# EAGLE schematic maus (EAGLE 9.6.2)

## Sheet 1 of 7
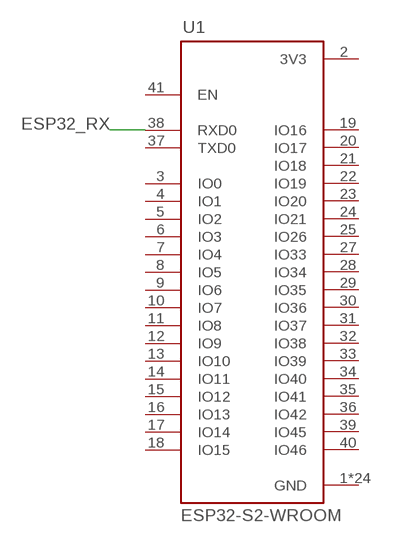
[diagram p0: schematic, sheet 1]

### Parts
U1  ESP32-S2-WROOM  [XCVR_ESP32-S2-WROOM]

### Nets
ESP32_RX: U1.38(RXD0) ; also sheet 3,4
Unconnected: U1.3(IO0) U1.4(IO1) U1.5(IO2) U1.6(IO3) U1.7(IO4) U1.8(IO5) U1.9(IO6) U1.10(IO7) U1.11(IO8) U1.12(IO9) U1.13(IO10) U1.14(IO11) U1.15(IO12) U1.16(IO13) U1.17(IO14) U1.18(IO15) U1.19(IO16) U1.20(IO17) U1.21(IO18) U1.22(IO19) U1.23(IO20) U1.24(IO21) U1.25(IO26) U1.27(IO33) U1.28(IO34) U1.29(IO35) U1.30(IO36) U1.31(IO37) U1.32(IO38) U1.33(IO39) U1.34(IO40) U1.35(IO41) U1.36(IO42) U1.37(TXD0) U1.39(IO45) U1.40(IO46) U1.41(EN)

## Sheet 2 of 7
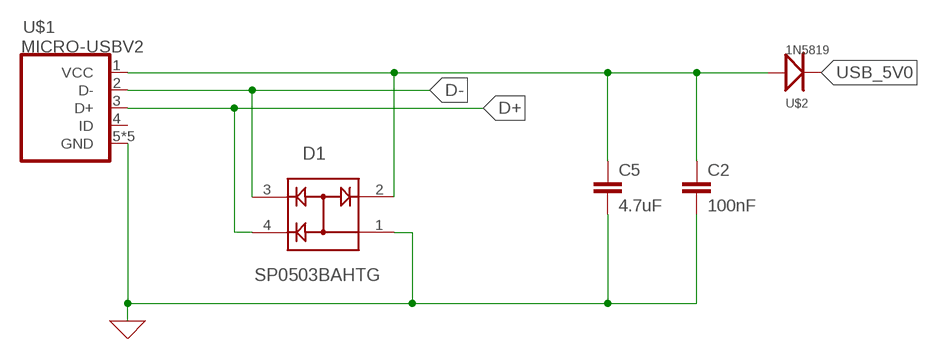
[diagram p1: schematic, sheet 2]

### Parts
C2  100nF  C-EUC0805  [C0805]
C5  4.7uF  C-EUC0805  [C0805]
D1  SP0503BAHTG  [SOT143]
U$1  MICRO-USBV2  [MICRO-USB-2]
U$2  1N5819  [SOD-123]

### Nets
0: C2.2 C5.2 D1.1 U$1.5(GND) U$1.P$1(GND) U$1.P$2(GND) U$1.P$3(GND) U$1.P$4(GND) ; supply symbol labelled GND ; also sheet 3,4
D+: D1.4 U$1.3(D+) ; also sheet 3,4
D-: D1.3 U$1.2(D-) ; also sheet 3,4
USB_5V0: C2.1 C5.1 D1.2 U$1.1(VCC) U$2.A ; also sheet 3,4
Unconnected: U$1.4(ID) U$2.K

## Sheet 3 of 7
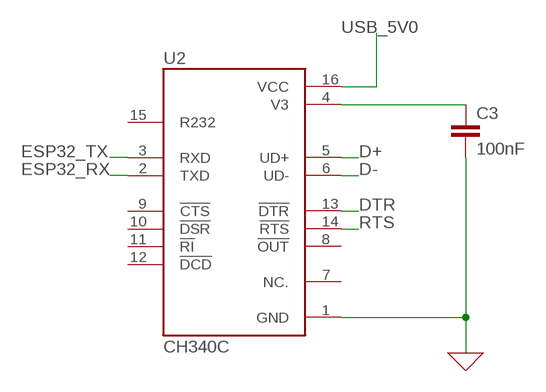
[diagram p2: schematic, sheet 3]

### Parts
C3  100nF  C-EUC0805  [C0805]
U2  CH340C  [SOIC127P600X180-16N]

### Nets
0: C3.2 U2.1(GND) ; supply symbol labelled GND ; also sheet 2,4
D+: U2.5(UD+) ; also sheet 2,4
D-: U2.6(UD-) ; also sheet 2,4
DTR: U2.13(!DTR) ; also sheet 4,5
ESP32_RX: U2.2(TXD) ; also sheet 1,4
ESP32_TX: U2.3(RXD) ; also sheet 4
N$2: C3.1 U2.4(V3)
RTS: U2.14(!RTS) ; also sheet 4,5
USB_5V0: U2.16(VCC) ; also sheet 2,4
Unconnected: U2.7(NC.) U2.8(!OUT) U2.9(!CTS) U2.10(!DSR) U2.11(!RI) U2.12(!DCD) U2.15(R232)

## Sheet 4 of 7
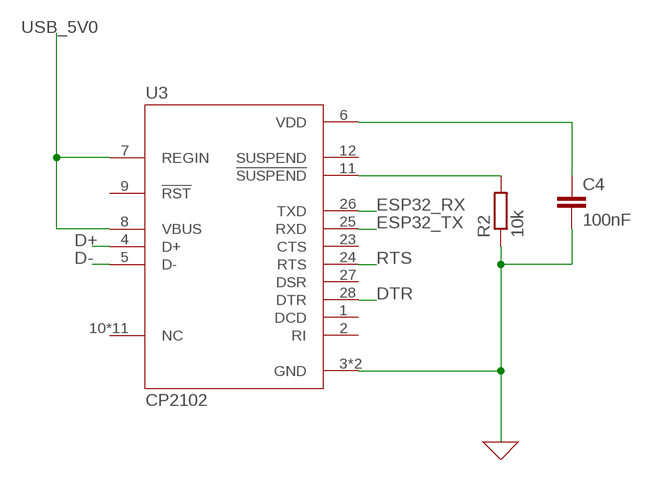
[diagram p3: schematic, sheet 4]

### Parts
C4  100nF  C-EUC0805  [C0805]
R2  10k  R-EU_R0805  [R0805]
U3  CP2102  [QFN50P500X500X100-29N]

### Nets
0: C4.2 R2.1 U3.3(GND) U3.29(GND) ; supply symbol labelled GND ; also sheet 2,3
D+: U3.4(D+) ; also sheet 2,3
D-: U3.5(D-) ; also sheet 2,3
DTR: U3.28(DTR) ; also sheet 3,5
ESP32_RX: U3.26(TXD) ; also sheet 1,3
ESP32_TX: U3.25(RXD) ; also sheet 3
N$3: R2.2 U3.11(!SUSPEND)
N$4: C4.1 U3.6(VDD)
RTS: U3.24(RTS) ; also sheet 3,5
USB_5V0: U3.7(REGIN) U3.8(VBUS) ; also sheet 2,3
Unconnected: U3.1(DCD) U3.2(RI) U3.9(!RST) U3.10(NC) U3.12(SUSPEND) U3.13(NC) U3.14(NC) U3.15(NC) U3.16(NC) U3.17(NC) U3.18(NC) U3.19(NC) U3.20(NC) U3.21(NC) U3.22(NC) U3.23(CTS) U3.27(DSR)

## Sheet 5 of 7
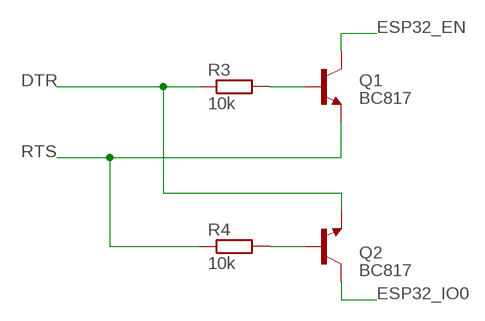
[diagram p4: schematic, sheet 5]

### Parts
Q1  BC817  [SOT95P230X110-3N]
Q2  BC817  [SOT95P230X110-3N]
R3  10k  R-EU_R0805  [R0805]
R4  10k  R-EU_R0805  [R0805]

### Nets
DTR: Q2.2(E) R3.1 ; also sheet 3,4
ESP32_EN: Q1.3(C)
ESP32_IO0: Q2.3(C)
N$5: Q1.1(B) R3.2
N$6: Q2.1(B) R4.2
RTS: Q1.2(E) R4.1 ; also sheet 3,4

## Sheet 6 of 7
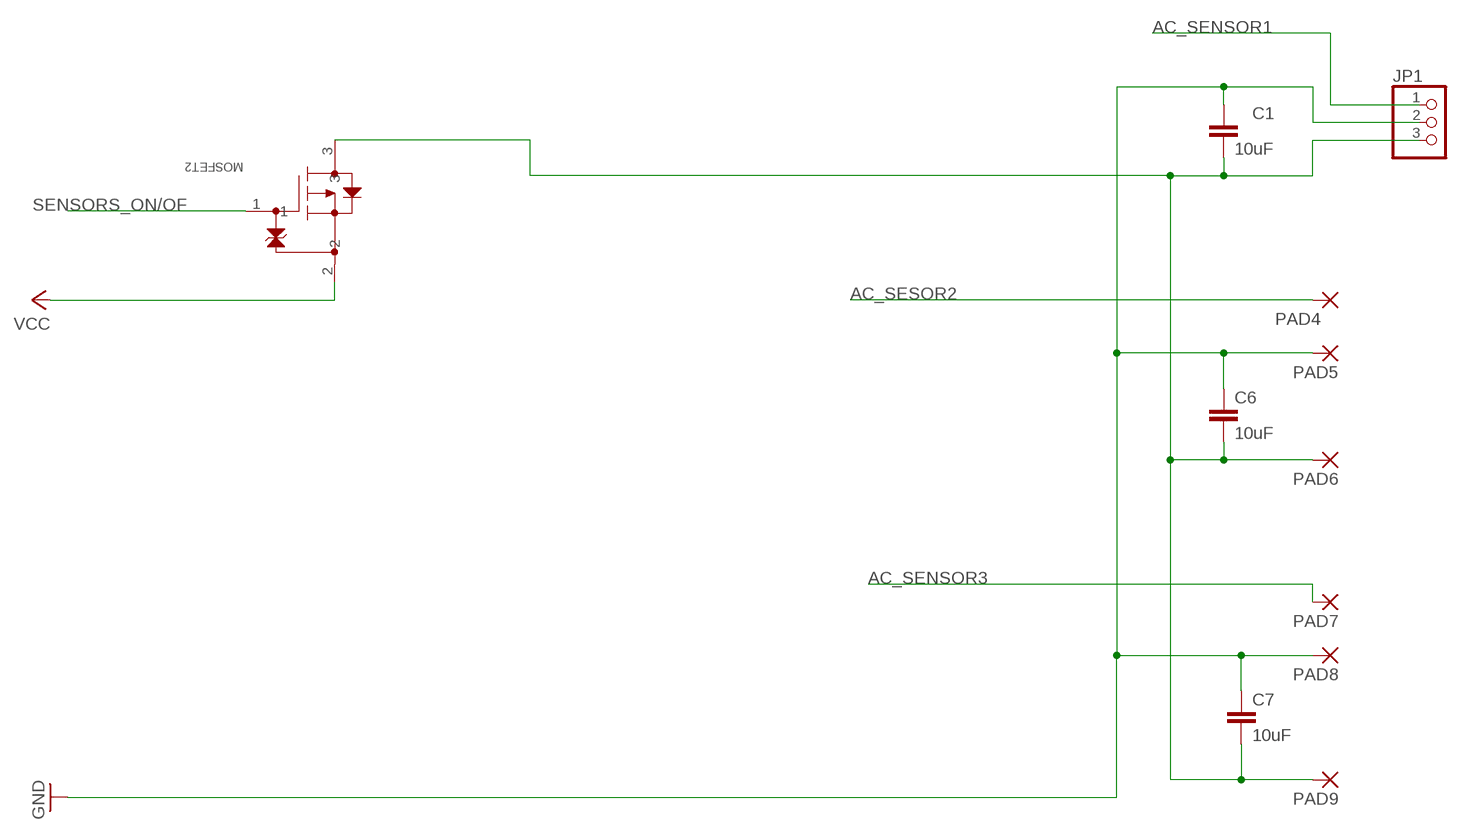
[diagram p5: schematic, sheet 6]

### Parts
C1  10uF  C-EUC0805  [C0805]
C6  10uF  C-EUC0805  [C0805]
C7  10uF  C-EUC0805  [C0805]
JP1  PINHD-1X3  [1X03]
MOSFET2  SSM3J117TU(TE85L)  [UFM_TOS]
PAD4  1,6/0,8  [1,6/0,8]
PAD5  1,6/0,8  [1,6/0,8]
PAD6  1,6/0,8  [1,6/0,8]
PAD7  1,6/0,8  [1,6/0,8]
PAD8  1,6/0,8  [1,6/0,8]
PAD9  1,6/0,8  [1,6/0,8]

### Nets
AC_SENSOR1: JP1.1
AC_SENSOR3: PAD7.1(P)
AC_SESOR2: PAD4.1(P)
GND: C1.1 C6.1 C7.1 JP1.2 PAD5.1(P) PAD8.1(P)
N$7: C1.2 C6.2 C7.2 JP1.3 MOSFET2.3 PAD6.1(P) PAD9.1(P)
SENSORS_ON/OF: MOSFET2.1
VCC: MOSFET2.2

## Sheet 7 of 7
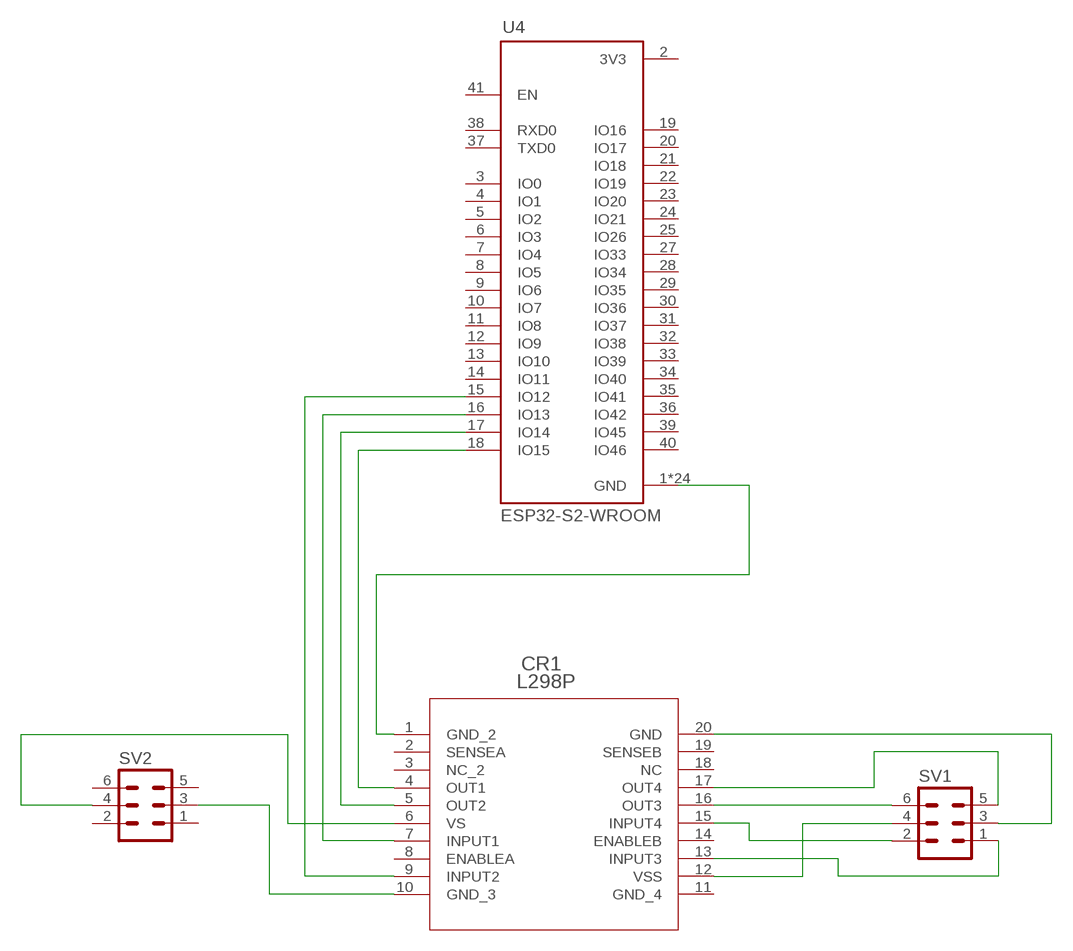
[diagram p6: schematic, sheet 7]

### Parts
CR1  L298P  [POWERSO-20_STM]
SV1  ML6  [ML6]
SV2  ML6  [ML6]
U4  ESP32-S2-WROOM  [XCVR_ESP32-S2-WROOM]

### Nets
N$8: CR1.1(GND_2) U4.1(GND) U4.26(GND) U4.42(GND) U4.43.1(GND) U4.43.2(GND) U4.43.3(GND) U4.43.4(GND) U4.43.5(GND) U4.43.6(GND) U4.43.7(GND) U4.43.8(GND) U4.43.9(GND) U4.43.10(GND) U4.43.11(GND) U4.43.12(GND) U4.43.13(GND) U4.43.14(GND) U4.43.15(GND) U4.43.16(GND) U4.43.17(GND) U4.43.18(GND) U4.43.19(GND) U4.43.20(GND) U4.43.21(GND)
N$9: CR1.4(OUT1) U4.18(IO15)
N$10: CR1.5(OUT2) U4.17(IO14)
N$11: CR1.7(INPUT1) U4.16(IO13)
N$12: CR1.9(INPUT2) U4.15(IO12)
N$13: CR1.12(VSS) SV1.4
N$14: CR1.20(GND) SV1.3
N$15: CR1.16(OUT3) SV1.6
N$16: CR1.17(OUT4) SV1.5
N$17: CR1.15(INPUT4) SV1.2
N$18: CR1.13(INPUT3) SV1.1
N$19: CR1.10(GND_3) SV2.3
N$20: CR1.6(VS) SV2.4
Unconnected: CR1.2(SENSEA) CR1.3(NC_2) CR1.8(ENABLEA) CR1.11(GND_4) CR1.14(ENABLEB) CR1.18(NC) CR1.19(SENSEB) SV2.1 SV2.2 SV2.5 SV2.6 U4.3(IO0) U4.4(IO1) U4.5(IO2) U4.6(IO3) U4.7(IO4) U4.8(IO5) U4.9(IO6) U4.10(IO7) U4.11(IO8) U4.12(IO9) U4.13(IO10) U4.14(IO11) U4.19(IO16) U4.20(IO17) U4.21(IO18) U4.22(IO19) U4.23(IO20) U4.24(IO21) U4.25(IO26) U4.27(IO33) U4.28(IO34) U4.29(IO35) U4.30(IO36) U4.31(IO37) U4.32(IO38) U4.33(IO39) U4.34(IO40) U4.35(IO41) U4.36(IO42) U4.37(TXD0) U4.38(RXD0) U4.39(IO45) U4.40(IO46) U4.41(EN)

## Power pins joined to a net without a drawn wire
3V3: U1.2(3V3) U4.2(3V3)
GND: U1.1(GND) U1.26(GND) U1.42(GND) U1.43.1(GND) U1.43.2(GND) U1.43.3(GND) U1.43.4(GND) U1.43.5(GND) U1.43.6(GND) U1.43.7(GND) U1.43.8(GND) U1.43.9(GND) U1.43.10(GND) U1.43.11(GND) U1.43.12(GND) U1.43.13(GND) U1.43.14(GND) U1.43.15(GND) U1.43.16(GND) U1.43.17(GND) U1.43.18(GND) U1.43.19(GND) U1.43.20(GND) U1.43.21(GND)

## Library data of the parts
C1-C7 = rcl:C-EU: CAPACITOR, European symbol; SPICEPREFIX: C
CR1 = shared:L298P; COPYRIGHT: Copyright (C) 2022 Ultra Librarian. All rights reserved.; MANUFACTURER_PART_NUMBER: L298P; MFR_NAME: STMicroelectronics
D1 = SP0503BAHTG:SP0503BAHTG: TVS DIODE 5.5VWM 8.5VC SOT143 Check availability <https://pricing.snapeda.com/parts/SP0503BAHTG/Littelfuse%20Inc./view-part?ref=eda>; AVAILABILITY: In Stock; DESCRIPTION: 8.5V Clamp - Ipp Tvs Diode Surface Mount SOT-143-4; MF: Littelfuse Inc.; MP: SP0503BAHTG; PACKAGE: None; PRICE: None; PURCHASE-URL: https://pricing.snapeda.com/search/part/SP0503BAHTG/?ref=eda
JP1 = pinhead:PINHD-1X3: PIN HEADER
MOSFET2 = SSM3J117TU:SSM3J117TU(TE85L); COPYRIGHT: Copyright (C) 2022 Ultra Librarian. All rights reserved.; MANUFACTURER_PART_NUMBER: SSM3J117TU(TE85L); MFR_NAME: Toshiba Electronic Devices & Storage Co.
PAD4-PAD9 = wirepad:1,6/0,8: THROUGH-HOLE PAD
Q1 Q2 = BC817:BC817: Transistor, Npn, 0.5a, 45v, Sot23 Check availability <https://pricing.snapeda.com/parts/BC817/Rectron/view-part?ref=eda>; AVAILABILITY: In Stock; DESCRIPTION: Bipolar (BJT) Transistor NPN 45V 500mA 100MHz 250mW Surface Mount TO-236AB; MF: Rectron; MP: BC817; PACKAGE: SOT-23-3 Rectron; PRICE: None
R2-R4 = rcl:R-EU_: RESISTOR, European symbol; SPICEPREFIX: R
SV1 SV2 = con-harting-ml:ML6: HARTING; OC_FARNELL: unknown; OC_NEWARK: unknown
U1 U4 = ESP32-S2-WROOM:ESP32-S2-WROOM: WiFi 802.11b/g/n Transceiver Module 2.4GHz PCB Trace Surface Mount Check availability <https://pricing.snapeda.com/parts/ESP32-S2-WROOM/Espressif%20Systems/view-part?ref=eda>; AVAILABILITY: In Stock; DESCRIPTION: WiFi 802.11b/g/n Transceiver Module 2.4GHz Antenna Not Included, I-PEX Surface Mount; MF: Espressif Systems; MP: ESP32-S2-WROOM; PACKAGE: VFQFN-56 Espressif Systems; PRICE: None; PURCHASE-URL: https://pricing.snapeda.com/search/part/ESP32-S2-WROOM/?ref=eda
U2 = CH340C:CH340C: USB to serial chip CH340 Check availability <https://pricing.snapeda.com/parts/CH340C/WCH/view-part?ref=eda>; AVAILABILITY: Not in stock; DESCRIPTION: USB to serial chip CH340; MF: WCH; MP: CH340C; PACKAGE: None; PRICE: None
U3 = CP2102:CP2102: USB to UART Bridge Check availability <https://pricing.snapeda.com/parts/CP2102/Silicon%20Labs/view-part?ref=eda>; AVAILABILITY: In Stock; DESCRIPTION: CP2102N USB 2.0 to UART (RS232) Bridge Interface Evaluation Board; MF: Silicon Labs; MP: CP2102; PACKAGE: WFQFN-20 Silicon Labs; PRICE: None; PURCHASE-URL: https://pricing.snapeda.com/search/part/CP2102/?ref=eda
U$1 = microusb:MICRO-USB: Micro USB B connector
U$2 = 1N5819:1N5819: Check availability <https://pricing.snapeda.com/parts/1N5819/STMicroelectronics/view-part?ref=eda>; AVAILABILITY: In Stock; DESCRIPTION: DIODE, SCHOTTKY, 1A, 40V; Diode Type:Schottky; Voltage, Vrrm:40V; Current, If AV:1A; Current, Ifsm:25A; Voltage, Vf Max:0.9V; Temperature, Tj Max:125°C; Termination Type:Axial Leaded; Case Style:DO-41; No. of Pins:2; Current, If ;RoHS Compliant: Yes; MF: STMicroelectronics; MP: 1N5819; PACKAGE: DO-41 Multicomp; PRICE: None; PURCHASE-URL: https://pricing.snapeda.com/search/part/1N5819/?ref=eda